# EAGLE design SparkFun_LiPo_Charger_Plus (EAGLE 9.1.1)
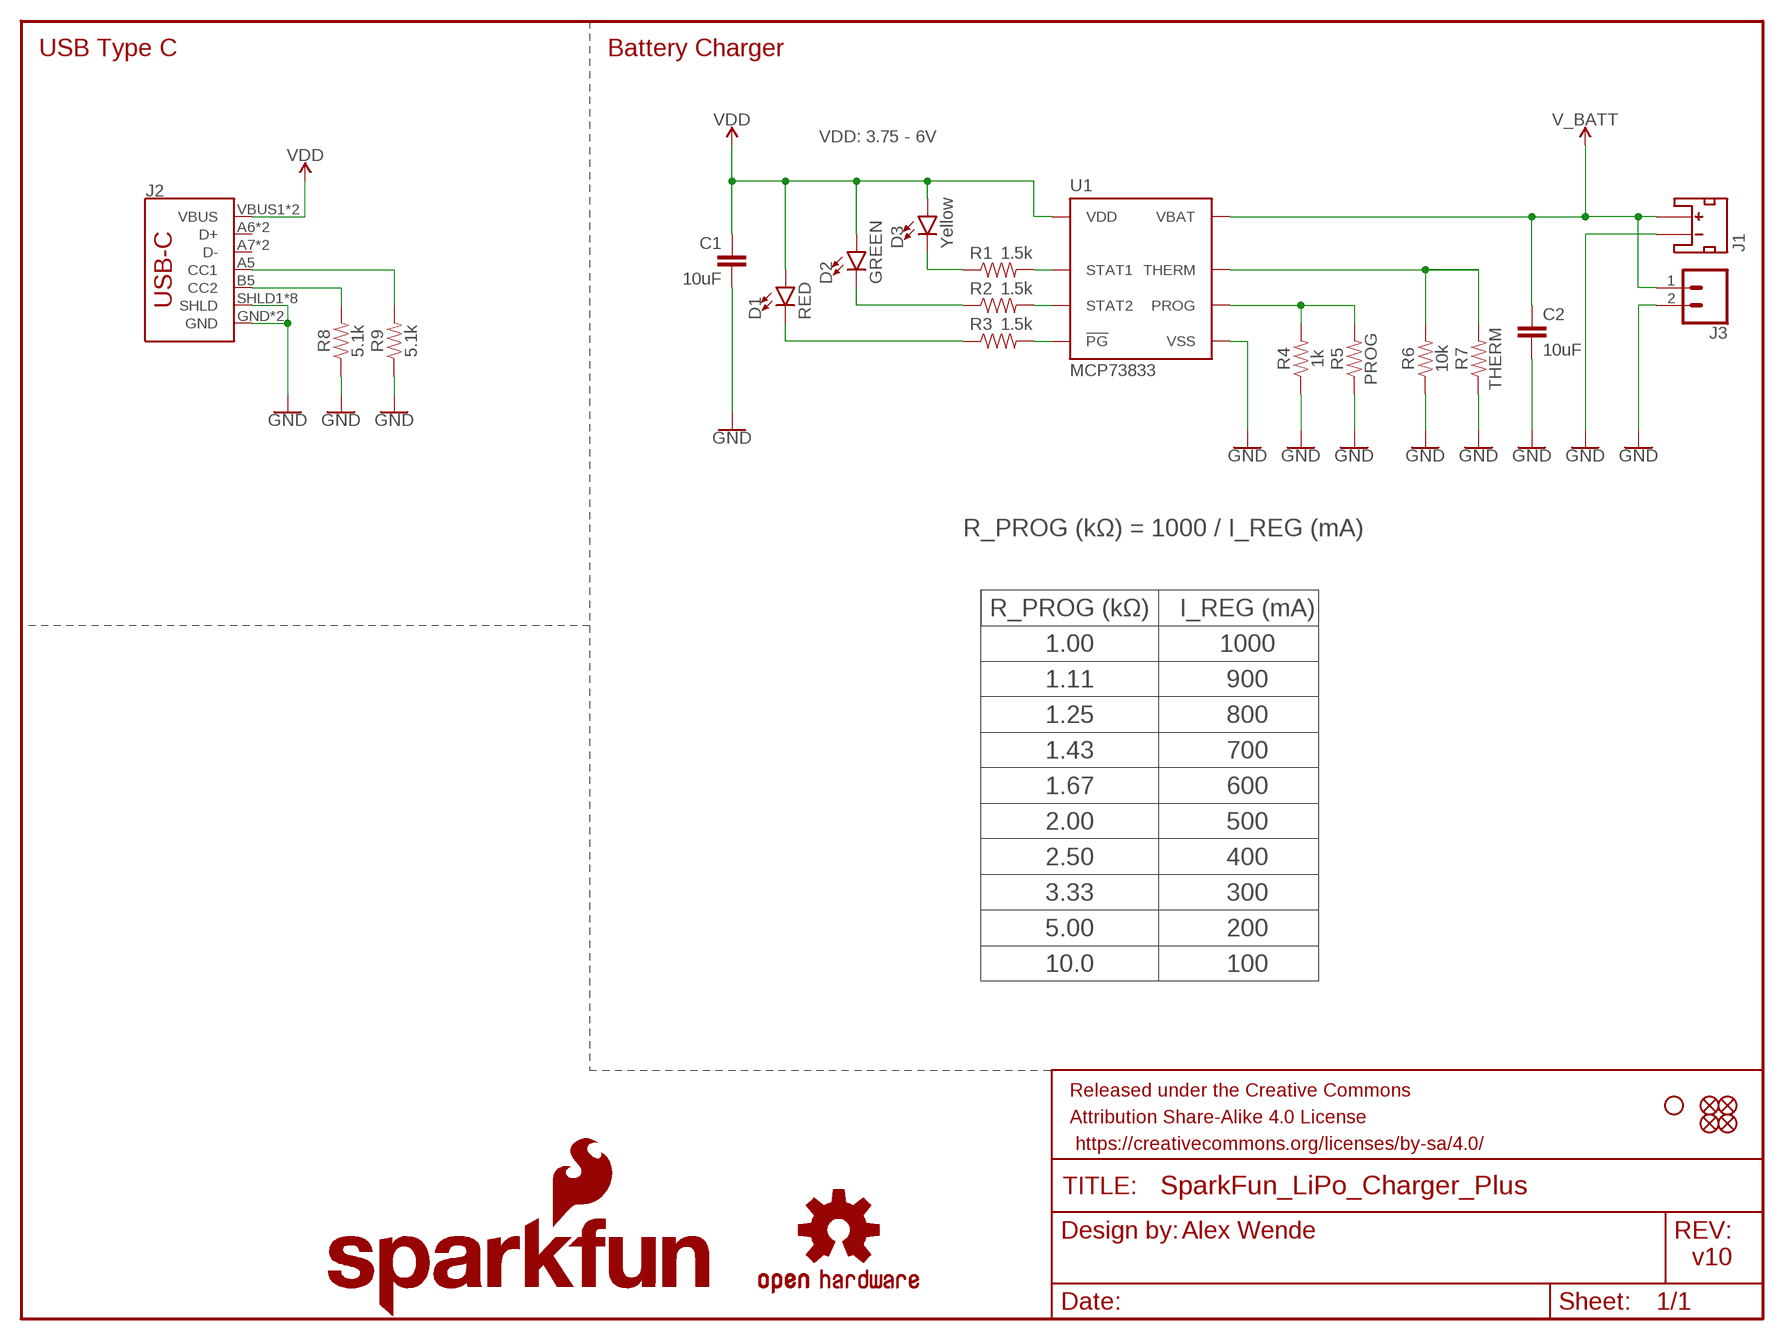
[diagram p0: schematic, sheet 1]

## Parts
C1  10uF  10UF-0603-6.3V-20%  [0603]
C2  10uF  10UF-0603-6.3V-20%  [0603]
D1  RED  LED-RED0603  [LED-0603]
D2  GREEN  LED-GREEN0603  [LED-0603]
D3  Yellow  LED-YELLOW0603  [LED-0603]
FD1  FIDUCIALUFIDUCIAL  [FIDUCIAL-MICRO]
FD2  FIDUCIALUFIDUCIAL  [FIDUCIAL-MICRO]
FD3  FIDUCIALUFIDUCIAL  [FIDUCIAL-MICRO]
FD4  FIDUCIALUFIDUCIAL  [FIDUCIAL-MICRO]
FRAME1  FRAME-LETTER  [CREATIVE_COMMONS]
H1  STAND-OFF  [STAND-OFF]
J1  JST_2MM_MALE  [JST-2-SMD]
J2  USB_C16PIN  [USB-C-16P]
J3  CONN_021X02_NO_SILK  [1X02_NO_SILK]
LOGO1  SFE_LOGO_NAME_FLAME.1_INCH  [SFE_LOGO_NAME_FLAME_.1]
LOGO2  OSHW-LOGOS  [OSHW-LOGO-S]
R1  1.5k  1.5KOHM-0603-1/10W-1%  [0603]
R2  1.5k  1.5KOHM-0603-1/10W-1%  [0603]
R3  1.5k  1.5KOHM-0603-1/10W-1%  [0603]
R4  1k  1KOHM-0603-1/10W-1%  [0603]
R5  PROG  RESISTORAXIAL-0.3  [AXIAL-0.3]
R6  10k  10KOHM-0603-1/10W-1%  [0603]
R7  THERM  RESISTORAXIAL-0.3  [AXIAL-0.3]
R8  5.1k  5.1KOHM5.1KOHM-0603-1/10W-1%  [0603]
R9  5.1k  5.1KOHM5.1KOHM-0603-1/10W-1%  [0603]
U1  MCP73833  [DFN-10]

## Nets
GND: C1.2 C2.2 J1.1(-) J2.GND J2.GND2(GND) J2.SHLD1(SHLD) J2.SHLD2(SHLD) J2.SHLD3(SHLD) J2.SHLD4(SHLD) J2.SHLD5(SHLD) J2.SHLD6(SHLD) J2.SHLD7(SHLD) J2.SHLD8(SHLD) J3.2 R4.1 R5.P$1 R6.1 R7.P$1 R8.1 R9.1 U1.P$5(VSS) U1.P$11(VSS)
N$4: D1.C R3.1
N$5: D2.C R2.1
N$6: D3.C R1.1
N$9: J2.B5(CC2) R8.2
N$13: J2.A5(CC1) R9.2
PG: R3.2 U1.P$7(!PG)
PROG: R4.2 R5.P$2 U1.P$6(PROG)
STAT1: R1.2 U1.P$3(STAT1)
STAT2: R2.2 U1.P$4(STAT2)
THERM: R6.2 R7.P$2 U1.P$8(THERM)
V_BATT: C2.1 J1.2(+) J3.1 U1.P$9(VBAT) U1.P$10(VBAT)
VDD: C1.1 D1.A D2.A D3.A J2.VBUS1(VBUS) J2.VBUS2(VBUS) U1.P$1(VDD) U1.P$2(VDD)
Unconnected: J1.NC1(PAD1) J1.NC2(PAD2) J2.A6(D+) J2.A7(D-) J2.B6(D+) J2.B7(D-)

## Notes on the sheet
- USB Type C | Battery Charger
- VDD: 3.75 - 6V
- R_PROG (kΩ) = 1000 / I_REG (mA)
- R_PROG (kΩ) | I_REG (mA)
- 1.00 | 1000
- 1.11 | 900
- 1.25 | 800
- 1.43 | 700
- 1.67 | 600
- 2.00 | 500
- 2.50 | 400
- 3.33 | 300
- 5.00 | 200
- 10.0 | 100
- Alex Wende
- v10

## Library data of the parts
C1 C2 = SparkFun-Capacitors:10UF: 10.0µF ceramic capacitors A capacitor is a passive two-terminal electrical component used to store electrical energy temporarily in an electric field.; PROD_ID: CAP-11015
D1 = SparkFun-LED:LED-RED: Red SMD LED Used in manufacturing of most products at SparkFun Packages: 0603 - SMD 0603 package [Product Link] <http://docs.avagotech.com/docs/AV02-0551EN> 0603 SMART - SMD 0603 SMART package ( more efficient and expensive)[Product Link] <http://www.osram-os.com/Graphics/XPic2/00077099_0.pdf> 1206 - SMD1206 package [Product Link] <https://www.sparkfun.com/datasheets/DevTools/LilyPad/Q150OVS4.pdff> SparkFun Products: Pro Mini 328 -5V <https://www.sparkfun.com/products/821> RedBoard <https://www.sparkfun.com/products/12757> IOIO-OTG <https://www.sparkfun.com/products/13613>; PROD_ID: DIO-00819
D2 = SparkFun-LED:LED-GREEN: Green SMD LED Used in manufacturing of various products at SparkFun Packages: 0603 - SMD 0603 package [Product Link] <http://www.futureelectronics.com/en/technologies/semiconductors/optoelectronics/leds/Pages/9894312-LTST-C190GKT.aspx?CrossPart=HSMG-C190&IM=0> LilyPad 1206 - SMD1206 LilyPad package [Product Link] <http://www.futureelectronics.com/en/Technologies/Product.aspx?ProductID=IN150NGHARVATEKCORPORATION2049943&IM=0> 1206 - SMD1206 package [Product Link] <http://www.futureelectronics.com/en/technologies/semiconductors/optoelectronics/leds/Pages/8315665-LTST-C150KGKT.aspx?IM=0> 1206 Bottom Mount -SMD 1206 Bottom Mount [Product Link] <http://www.digikey.com/product-detail/en/lite-on-inc/LTST-C230KGKT/160-1456-1-ND/386854> SparkFun Products: Pro Mini 328 -5V <https://www.sparkfun.com/products/821> RedBoard <https://www.sparkfun.com/products/12757> MP3 Trigger <https://www.sparkfun.com/products/13720> Makey Makey <https://www.sparkfun.com/products/11076>; PROD_ID: DIO-00821
D3 = SparkFun-LED:LED-YELLOW: Yellow SMD LED Used in manufacturing several products at SparkFun. Packages: 0603 - SMD 0603 package[Product Link] <http://www.kingbrightusa.com/product.asp?catalog_name=LED&product_id=APT1608SYCK> 0603 -SMART - SMART SMD 0603 package (more efficient/more expensive) [Product Link] <http://www.osram-os.com/osram_os/en/products/product-catalog/led-light-emitting-diodes/smartled-0603/ly-l29k/index.jsp> LilyPad - SMD1206 package[Product Datasheet] <https://www.sparkfun.com/datasheets/DevTools/LilyPad/Q150YUS4.pdf> SparkFun Products: Blynk Board <https://www.sparkfun.com/products/13794> IOIO-OTG <https://www.sparkfun.com/products/13613> XBee Explorer Serial <https://www.sparkfun.com/products/13225>; PROD_ID: DIO-09003
FD1-FD4 = SparkFun-Aesthetics:FIDUCIAL: Fiducial Alignment Points Point-of-reference for pick-and-place machines and other optical instruments.
FRAME1 = SparkFun-Aesthetics:FRAME-LETTER: Schematic Frame - Letter Standard 8.5x11 US Letter frame
H1 = SparkFun-Hardware:STAND-OFF: Stand Off Drill holes for mechanically mounting via screws, standoffs, etc. Note: Use the keepout ring to avoid running the screw head into surrounding components. Variant Overviews STAND-OFF - Mechanical footprint for a #4 phillips button head screw. STAND-OFF-TIGHT - Mechanical footprint for a #4 phillips button head screw, Example SparkFun Products Screw - Phillips Head (1/4", 4-40, 10 pack) <https://www.sparkfun.com/products/10453> (PRT-10453) Screw - Phillips Head (1/2", 4-40, 10 pack) <https://www.sparkfun.com/products/10452> (PRT-10452) Screw - Phillips Head (3/4", 4-40, 10 pack) <https://www.sparkfun.com/products/10451> (PRT-10451) Screw - Phillips Head (1", 4-40, 10 pack) <https://www.sparkfun.com/products/10450> (PRT-10450)
J1 = SparkFun-Connectors:JST_2MM_MALE: JST 2MM MALE RA CONNECTOR Two pin, compact surface mount connector. Commonly used as a battery input connection point. We really like the solid locking feeling and high current rating on these small connectors. We use these all the time as battery connectors. Mates to single-cell LiPo batteries. Here is the connector we sell at SparkFun: JST Right Angle Connector - White <https://www.sparkfun.com/products/8612> (PRT-08612) Datasheet <http://www.sparkfun.com/datasheets/Prototyping/Connectors/JST-Horizontal.pdf> It was used on these SparkFun products: SparkFun MOSFET Power Controller <https://www.sparkfun.com/products/11214> (PRT-11214) SparkFun Battery Babysitter - LiPo Battery Manager <https://www.sparkfun.com/products/13777> (PRT-13777) And many, many others that required a lipo battery connection.; PROD_ID: CONN-11443; SF_ID: PRT-08612
J2 = SparkFun-Connectors:USB_C: USB Type C 16Pin Connector Super Speed pins not available on the 16-pin purely SMD connector so this part is best for USB 2.0 implementations. D1 and D2 are tied together enabling D+/- no matter which way the cable is plugged into the connector. The two channel configuration pins (CC1/2) are exposed. These are normally connected to ground via 5.1k resistors but can be reconfigured for high current/high power applications.; PROD_ID: CONN-14122
J3 = SparkFun-Connectors:CONN_02: Multi connection point. Often used as Generic Header-pin footprint for 0.1 inch spaced/style header connections On any of the 0.1 inch spaced packages, you can populate with these: Break Away Headers - Straight <https://www.sparkfun.com/products/116> (PRT-00116) Break Away Male Headers - Right Angle <https://www.sparkfun.com/products/553> (PRT-00553) Female Headers <https://www.sparkfun.com/products/115> (PRT-00115) Break Away Headers - Machine Pin <https://www.sparkfun.com/products/117> (PRT-00117) Break Away Female Headers - Swiss Machine Pin <https://www.sparkfun.com/products/743> (PRT-00743) For SCREWTERMINALS and SPRING TERMINALS visit here: Screw Terimnals on SparkFun.com <https://www.sparkfun.com/search/results?term=Screw+Terminals> (5mm/3.5mm/2.54mm spacing) This device is also useful as a general connection point to wire up your design to another part of your project. Our various solder wires solder well into these plated through hole pads. Hook-Up Wire - Assortment (Stranded, 22 AWG) <https://www.sparkfun.com/products/11375> (PRT-11375) Hook-Up Wire - Assortment (Solid Core, 22 AWG) <https://www.sparkfun.com/products/11367> (PRT-11367) View the entire wire category on our website here <https://www.sparkfun.com/categories/141> Special notes: Molex polarized connector foot print use with: PRT-08233 with associated crimp pins and housings. 2.54_SCREWTERM for use with PRT-10571. 3.5mm Screw Terminal footprints for PRT-08084 5mm Screw Terminal footprints for use with PRT-08432
LOGO1 = SparkFun-Aesthetics:SFE_LOGO_NAME_FLAME: SparkFun Font Logo w/ Flame This is the SparkFun full logo. The logo on the schematic will always be the same size; the package variant is the height of the flame part of the logo. Default layer for the logo on the board is tSilk.
LOGO2 = SparkFun-Aesthetics:OSHW-LOGO: Open-Source Hardware (OSHW) Logo This logo indicates the piece of hardware it is found on incorporates a OSHW license and/or adheres to the definition of open source hardware found here: http://freedomdefined.org/OSHW
R1-R3 = SparkFun-Resistors:1.5KOHM: 1.5kΩ resistor A resistor is a passive two-terminal electrical component that implements electrical resistance as a circuit element. Resistors act to reduce current flow, and, at the same time, act to lower voltage levels within circuits. - Wikipedia; PROD_ID: RES-08306
R4 = SparkFun-Resistors:1KOHM: 1kΩ resistor A resistor is a passive two-terminal electrical component that implements electrical resistance as a circuit element. Resistors act to reduce current flow, and, at the same time, act to lower voltage levels within circuits. - Wikipedia; PROD_ID: RES-07856
R5 R7 = SparkFun-Resistors:RESISTOR: Generic Resistor Package
R6 = SparkFun-Resistors:10KOHM: 10kΩ resistor A resistor is a passive two-terminal electrical component that implements electrical resistance as a circuit element. Resistors act to reduce current flow, and, at the same time, act to lower voltage levels within circuits. - Wikipedia; PROD_ID: RES-00824
R8 R9 = SparkFun-Resistors:5.1KOHM; PROD_ID: RES-12083
U1 = SparkFun-IC-Power:MCP73833; PROD_ID: IC-14369

## Board
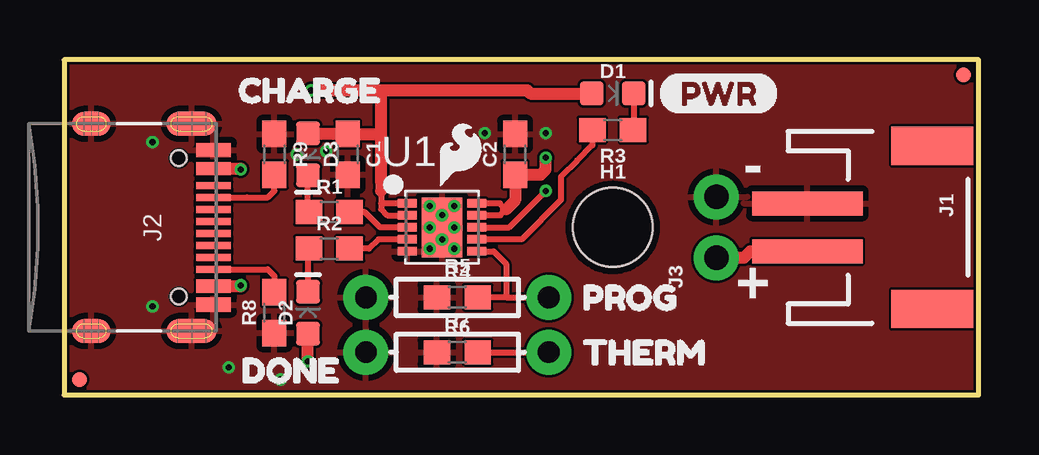
[diagram p1: board, top side]
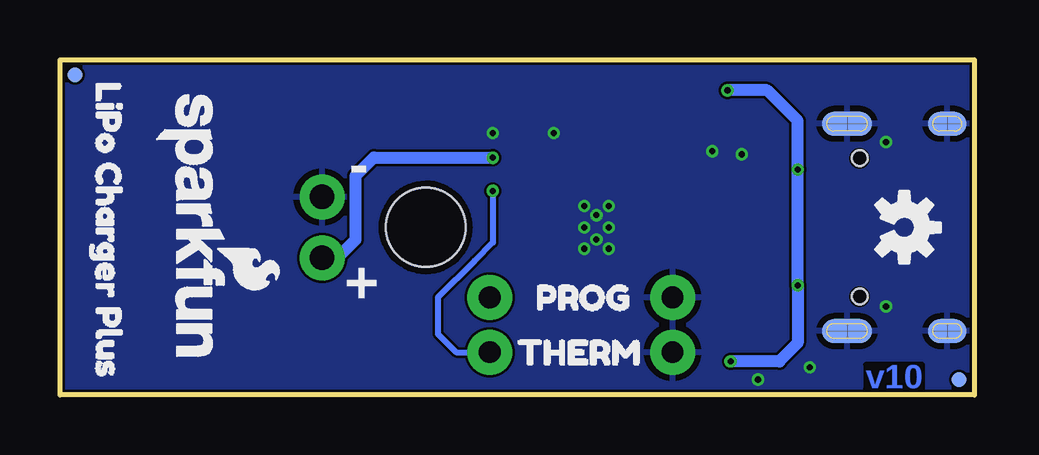
[diagram p2: board, bottom side, seen from below]

Size 38.1 x 13.97 mm. Coordinates in mm from the lower left corner, seen from the top.
Outline: 0,0 38.1,0 38.1,13.97 0,13.97 0,0
Copper layers (1*16): Top 0.035mm / dielectric 1.5mm / Bottom 0.035mm
Design rules "SparkFun-2-layer-FAB-LIMIT": minimum track width 4mil, minimum drill 6mil, track to track 4mil, track to pad 4mil, pad to pad 4mil, via to via 4mil, smd to smd 4mil, copper to edge 4mil, drill to drill 4mil, minimum pad ring 5mil, minimum via ring 5mil, stop-mask expansion 4mil, vias tented up to drill 25mil, thermal gap 10mil
tRestrict: 2 lines

### Footprints (pad centres in the part's own frame; a part is rotated, then mirrored left to right if it is on the bottom)
0603 = smd 1.1 x 1: 1 -0.85,0; 2 0.85,0
LED-0603 = smd 1 x 1: A -0.877,0; C 0.877,0
FIDUCIAL-MICRO = smd 0.635 x 0.635: 1 0,0
STAND-OFF = hole 3.302: 0,0
JST-2-SMD = smd 1 x 4.6: 1 -1,-3.7; 2 1,-3.7 | smd 1.6 x 3.4: NC1 -3.4,1.5; NC2 3.4,1.5
USB-C-16P = smd 0.3 x 1.45: A5 -1.25,0; A6 -0.25,0; A7 0.25,0; A8 1.25,0; B5 1.75,0; B6 0.75,0; B7 -0.75,0; B8 -1.75,0 | smd 0.6 x 1.45: GND -3.225,0; GND2 3.225,0 | smd 1 x 2.1: SHLD1 -4.32,-0.915; SHLD2 4.32,-0.915 | smd 1 x 2.1 bottom: SHLD3 -4.32,-0.915; SHLD4 4.32,-0.915 | smd 1 x 1.6: SHLD5 -4.32,-5.095; SHLD8 4.32,-5.095 | smd 1 x 1.6 bottom: SHLD6 -4.32,-5.095; SHLD7 4.32,-5.095 | smd 0.55 x 1.45: VBUS1 -2.45,0; VBUS2 2.45,0 | hole 0.65: -2.89,-1.445; 2.89,-1.445
1X02_NO_SILK = drill 1.016 pad 1.88: 1 0,0; 2 2.54,0
AXIAL-0.3 = drill 0.9 pad 1.88: P$1 -3.81,0; P$2 3.81,0
DFN-10 = smd 0.8 x 0.35: P$1 -1.45,1; P$2 -1.45,0.5; P$3 -1.45,0; P$4 -1.45,-0.5; P$5 -1.45,-1; P$6 1.45,-1; P$7 1.45,-0.5; P$8 1.45,0; P$9 1.45,0.5; P$10 1.45,1 | smd 1.7 x 2.5: P$11 0,0

### Placement (x,y rotation side)
C1  11.81,10.03 270 top
C2  18.8,10.03 90 top
D1  22.86,12.57 0 top
D2  10.16,3.43 90 top
D3  10.16,10.03 270 top
FD1  0.64,0.64 0 top
FD2  0.64,0.64 0 bottom
FD3  37.47,13.34 0 top
FD4  37.47,13.34 0 bottom
FRAME1  -1.91,-24.13 0 top  (outside the outline)
H1  22.86,6.99 0 top
J1  34.67,6.99 270 top
J2  6.22,6.99 270 top
J3  27.18,5.71 90 top
LOGO1  32.64,6.99 270 bottom
LOGO2  2.92,6.99 270 bottom
R1  11.05,7.62 0 top
R2  11.05,6.1 0 top
R3  22.86,11.05 180 top
R4  16.38,4.06 0 top
R5  16.38,4.06 0 top
R6  16.38,1.78 0 top
R7  16.38,1.78 0 top
R8  8.76,3.43 90 top
R9  8.76,10.03 270 top
U1  15.75,6.99 0 top
U$1  [SFE_LOGO_FLAME_.1]  16.51,10.03 0 top
U$2  [PROG7]  19.18,4.06 0 bottom
U$3  [CHARGE3]  6.35,12.7 0 top
U$4  [DONE4]  6.48,1.02 0 top
U$5  [PROG7]  20.7,4.06 0 top
U$6  [THERM8]  20.7,1.78 0 top
U$7  [PWR6]  24.77,12.57 0 top
U$8  [THERM8]  19.94,1.78 0 bottom
U$9  [LIPO_CHARGER_PLUS0]  36.07,13.97 270 bottom

### Tracks (layer width: path | path; a pad name or v marks a point on that pad's centre or on a via)
GND  (via drill 0.25)
  other vias: 15.24,7.87 16.26,7.87 15.75,7.49 15.24,6.99 16.26,6.99 15.75,6.48 15.24,6.1 16.26,6.1 20.07,10.92 17.53,10.92 9.69,10.03 10.92,10.16 6.86,1.14 9.02,0.64 3.68,3.68 3.68,10.54
  pour Top: 0,0 0,13.97 38.1,13.97 38.1,0
  pour Bottom: 0,0 0,13.97 38.1,13.97 38.1,0
N$4
  Top 0.254: D1.C 23.74,11.05 R3.1
N$5
  Top 0.254: R2.1 10.16,6.1 D2.C
N$6
  Top 0.254: R1.1 10.16,7.62 D3.C
N$9
  Top 0.254: J2.B5 8.48,5.24 8.76,4.95 R8.2
N$13
  Top 0.254: J2.A5 7.62,8.23 8.49,8.23 8.76,8.51 R9.2
PG
  Top 0.254: U1.P$7 19.06,6.49 20.7,8.13 20.7,9.11 21.38,9.78 22.01,10.41 R3.2
PROG
  Top 0.254: 18.41,4.06 R4.2 | U1.P$6 17.89,5.99 18.41,5.46 18.41,4.06 | 18.41,4.06 R5.P$2
STAT1
  Top 0.254: U1.P$3 13.17,6.99 12.53,7.62 R1.2
STAT2
  Top 0.254: U1.P$4 13.09,6.49 12.7,6.1 R2.2
THERM  (via drill 0.25)
  Top 0.254: U1.P$8 18.54,6.99 v20.07,8.51 | R6.2 R7.P$2
  Bottom 0.254: R7.P$2 21.59,1.78 22.35,2.54 22.35,4.06 20.83,5.59 20.07,6.35 v20.07,8.51
V_BATT  (via drill 0.25)
  Top 0.254: U1.P$10 18.16,7.99 18.41,7.73 18.18,7.49 U1.P$9
  Top 0.508: J1.2 28.59,5.99 28.32,5.71 J3.1 | 18.41,7.73 18.8,8.11 C2.1 19.85,9.18 20.07,9.4 v20.07,9.89
  Bottom 0.508: J3.1 26.54,5.71 25.78,6.48 25.78,9.14 25.02,9.91 20.08,9.91 v20.07,9.89
VDD  (via drill 0.25)
  Top 0.254: 13.21,7.99 13.21,7.75 13.47,7.49 U1.P$2 | U1.P$1 13.21,7.99 | 13.21,8.51 13.21,7.99 | 10.79,12.7 10.99,12.7
  Top 0.508: J2.VBUS1 7.37,9.44 v7.37,9.4 | J2.VBUS2 7.37,4.54 v7.37,4.57 | 13.21,8.51 13.21,8.89 13.21,10.92 | v10.16,1.4 D2.A | v10.29,12.7 10.79,12.7 10.99,12.7 13.21,12.7 | 13.21,12.7 19.3,12.7 19.43,12.57 D1.A | 13.21,10.92 13.21,12.7 | 13.21,10.92 13.21,10.88 C1.1 10.16,10.88 D3.A
  Bottom 0.508: v10.16,1.4 8.13,1.4 7.37,2.16 v7.37,4.57 v7.37,9.4 7.37,11.43 8.64,12.7 v10.29,12.7

### Text on the board
Bottom: v10
tPlace: - | +
bPlace: - | +
tDocu: Alex Wende